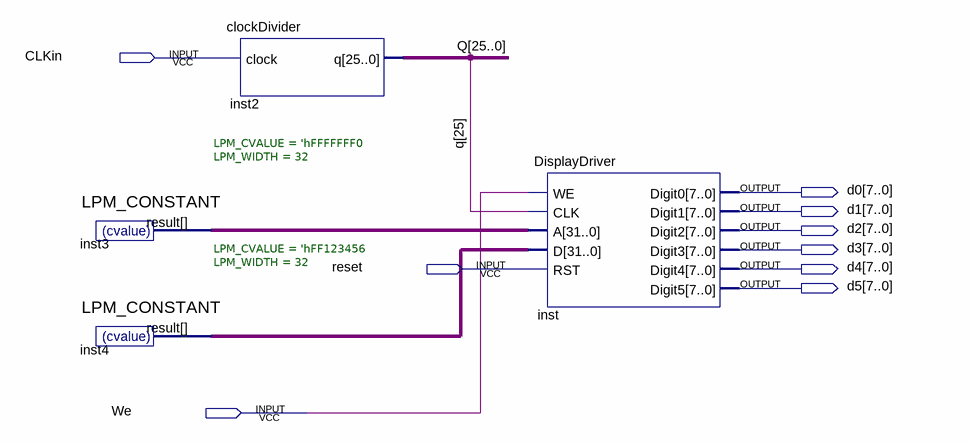
[diagram p0: schematic sheet]
// Quartus schematic test.bdf as structural Verilog: 4 symbols, 9 pins
module test (
  input  CLKin,
  input  reset,
  input  We,
  output [7:0] d0,
  output [7:0] d1,
  output [7:0] d2,
  output [7:0] d3,
  output [7:0] d4,
  output [7:0] d5
);

  wire [25:0] Q;
  wire [31:0] inst3_result, inst4_result;

  LPM_CONSTANT #(.LPM_CVALUE('hFFFFFFF0), .LPM_WIDTH(32)) inst3 (.result(inst3_result));
  LPM_CONSTANT #(.LPM_CVALUE('hFF123456), .LPM_WIDTH(32)) inst4 (.result(inst4_result));
  clockDivider inst2 (.clock(CLKin), .q(Q));
  DisplayDriver inst (
    .WE(We), .CLK(Q[25]), .A(inst3_result), .D(inst4_result), .RST(reset), .Digit0(d0), .Digit1(d1),
    .Digit2(d2), .Digit3(d3), .Digit4(d4), .Digit5(d5));
endmodule
